# Altium schematic sheet AFPGA_power.SchDoc: Application FPGA
size 420 x 297 mm; CheckedBy: T.Janicki; CompanyName: Creotech Instruments SA; DrawnBy: G.Kasprowicz; Organization: CERN; Address1: European Organization for Nuclear Research; Address2: CH-1211 Geneve 23 - Switzerland; DocumentNumber: 10; Revision: -; SheetNumber: 8; SheetTotal: 21; EDA_Number: EDA-xxxx; Projet: Simple VME FMC Carrier; CreateDate: 20/11/2012; CheckedDate: 30/04/2012; Title2: power supply; DivGrp: BE-CO; Designer: G.Kasprowicz; DocumentName: AFPGA_power.SchDoc; ModifiedDate: -; Rule: PcbType=ProtelPcb
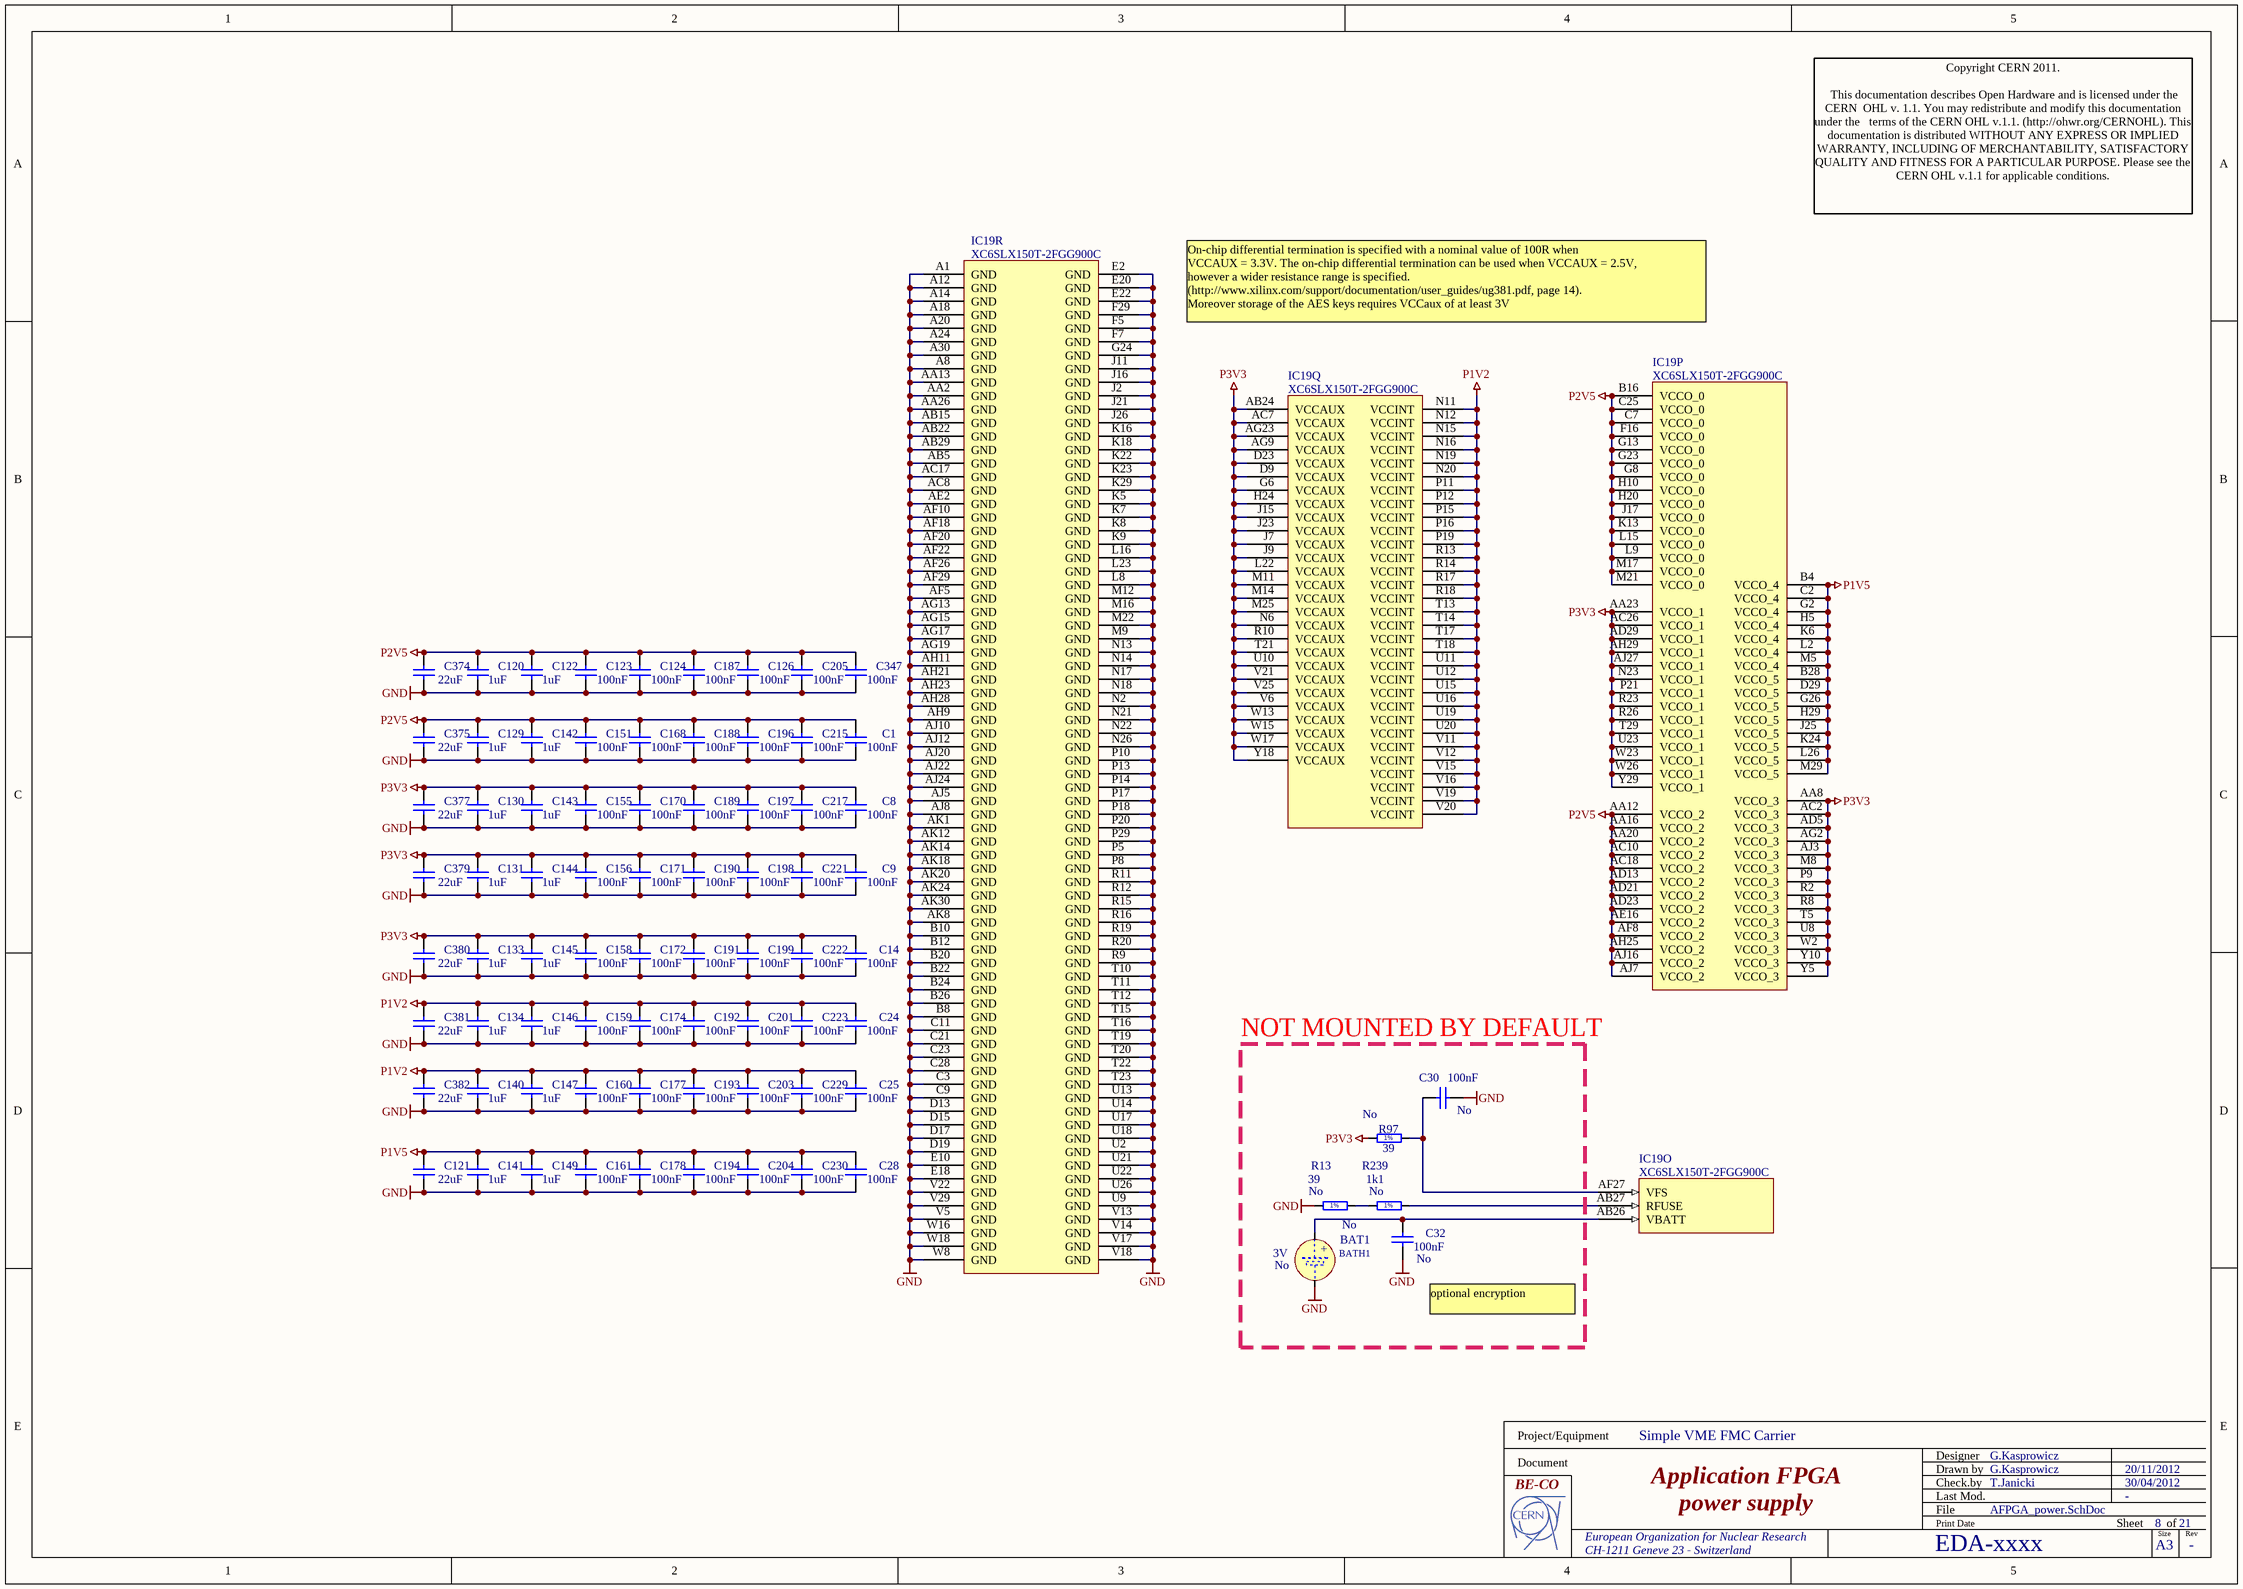
[diagram p0: AFPGA_power.SchDoc]

## Parts
BAT1  3V  Mounted: No  [BAT_VARTA_CR1220]
BATH1  Mounted: No  [BATH_KEYSTONE_3000]
C1  100nF  [CAPC1005X55N]
C8  100nF  [CAPC1005X55N]
C9  100nF  [CAPC1005X55N]
C14  100nF  [CAPC1005X55N]
C24  100nF  [CAPC1005X55N]
C25  100nF  [CAPC1005X55N]
C28  100nF  [CAPC1005X55N]
C30  100nF  Mounted: No  [CAPC1005X55N]
C32  100nF  Mounted: No  [CAPC1005X55N]
C120  1uF  [CAPC1608X87N]
C121  22uF  [CAPC3216X180N]
C122  1uF  [CAPC1608X87N]
C123  100nF  [CAPC1005X55N]
C124  100nF  [CAPC1005X55N]
C126  100nF  [CAPC1005X55N]
C129  1uF  [CAPC1608X87N]
C130  1uF  [CAPC1608X87N]
C131  1uF  [CAPC1608X87N]
C133  1uF  [CAPC1608X87N]
C134  1uF  [CAPC1608X87N]
C140  1uF  [CAPC1608X87N]
C141  1uF  [CAPC1608X87N]
C142  1uF  [CAPC1608X87N]
C143  1uF  [CAPC1608X87N]
C144  1uF  [CAPC1608X87N]
C145  1uF  [CAPC1608X87N]
C146  1uF  [CAPC1608X87N]
C147  1uF  [CAPC1608X87N]
C149  1uF  [CAPC1608X87N]
C151  100nF  [CAPC1005X55N]
C155  100nF  [CAPC1005X55N]
C156  100nF  [CAPC1005X55N]
C158  100nF  [CAPC1005X55N]
C159  100nF  [CAPC1005X55N]
C160  100nF  [CAPC1005X55N]
C161  100nF  [CAPC1005X55N]
C168  100nF  [CAPC1005X55N]
C170  100nF  [CAPC1005X55N]
C171  100nF  [CAPC1005X55N]
C172  100nF  [CAPC1005X55N]
C174  100nF  [CAPC1005X55N]
C177  100nF  [CAPC1005X55N]
C178  100nF  [CAPC1005X55N]
C187  100nF  [CAPC1005X55N]
C188  100nF  [CAPC1005X55N]
C189  100nF  [CAPC1005X55N]
C190  100nF  [CAPC1005X55N]
C191  100nF  [CAPC1005X55N]
C192  100nF  [CAPC1005X55N]
C193  100nF  [CAPC1005X55N]
C194  100nF  [CAPC1005X55N]
C196  100nF  [CAPC1005X55N]
C197  100nF  [CAPC1005X55N]
C198  100nF  [CAPC1005X55N]
C199  100nF  [CAPC1005X55N]
C201  100nF  [CAPC1005X55N]
C203  100nF  [CAPC1005X55N]
C204  100nF  [CAPC1005X55N]
C205  100nF  [CAPC1005X55N]
C215  100nF  [CAPC1005X55N]
C217  100nF  [CAPC1005X55N]
C221  100nF  [CAPC1005X55N]
C222  100nF  [CAPC1005X55N]
C223  100nF  [CAPC1005X55N]
C229  100nF  [CAPC1005X55N]
C230  100nF  [CAPC1005X55N]
C347  100nF  [CAPC1005X55N]
C374  22uF  [CAPC3216X180N]
C375  22uF  [CAPC3216X180N]
C377  22uF  [CAPC3216X180N]
C379  22uF  [CAPC3216X180N]
C380  22uF  [CAPC3216X180N]
C381  22uF  [CAPC3216X180N]
C382  22uF  [CAPC3216X180N]
IC19  XC6SLX150T-2FGG900C  [BGA900C100P30X30_3100X3100X260]  (parts O,P,Q,R of 18)
R13  39  Mounted: No  [RESC1608X55N]
R97  39  Mounted: No  [RESC1608X55N]
R239  1k1  Mounted: No  [RESC1608X55N]

## Blocks framed on the sheet
NOT MOUNTED BY DEFAULT: BAT1 BATH1 C30 C32 R13 R97 R239

## Nets
GND: BATH1.2(MINUS) C1.1 C8.1 C9.1 C14.1 C24.1 C25.1 C28.1 C30.1 C32.1 C120.1 C121.1 C122.1 C123.1 C124.1 C126.1 C129.1 C130.1 C131.1 C133.1 C134.1 C140.1 C141.1 C142.1 C143.1 C144.1 C145.1 C146.1 C147.1 C149.1 C151.1 C155.1 C156.1 C158.1 C159.1 C160.1 C161.1 C168.1 C170.1 C171.1 C172.1 C174.1 C177.1 C178.1 C187.1 C188.1 C189.1 C190.1 C191.1 C192.1 C193.1 C194.1 C196.1 C197.1 C198.1 C199.1 C201.1 C203.1 C204.1 C205.1 C215.1 C217.1 C221.1 C222.1 C223.1 C229.1 C230.1 C347.1 C374.1 C375.1 C377.1 C379.1 C380.1 C381.1 C382.1 IC19.A1(GND) IC19.A8(GND) IC19.A12(GND) IC19.A14(GND) IC19.A18(GND) IC19.A20(GND) IC19.A24(GND) IC19.A30(GND) IC19.AA2(GND) IC19.AA13(GND) IC19.AA26(GND) IC19.AB5(GND) IC19.AB15(GND) IC19.AB22(GND) IC19.AB29(GND) IC19.AC8(GND) IC19.AC17(GND) IC19.AE2(GND) IC19.AF5(GND) IC19.AF10(GND) IC19.AF18(GND) IC19.AF20(GND) IC19.AF22(GND) IC19.AF26(GND) IC19.AF29(GND) IC19.AG13(GND) IC19.AG15(GND) IC19.AG17(GND) IC19.AG19(GND) IC19.AH9(GND) IC19.AH11(GND) IC19.AH21(GND) IC19.AH23(GND) IC19.AH28(GND) IC19.AJ5(GND) IC19.AJ8(GND) IC19.AJ10(GND) IC19.AJ12(GND) IC19.AJ20(GND) IC19.AJ22(GND) IC19.AJ24(GND) IC19.AK1(GND) IC19.AK8(GND) IC19.AK12(GND) IC19.AK14(GND) IC19.AK18(GND) IC19.AK20(GND) IC19.AK24(GND) IC19.AK30(GND) IC19.B8(GND) IC19.B10(GND) IC19.B12(GND) IC19.B20(GND) IC19.B22(GND) IC19.B24(GND) IC19.B26(GND) IC19.C3(GND) IC19.C9(GND) IC19.C11(GND) IC19.C21(GND) IC19.C23(GND) IC19.C28(GND) IC19.D13(GND) IC19.D15(GND) IC19.D17(GND) IC19.D19(GND) IC19.E2(GND) IC19.E10(GND) IC19.E18(GND) IC19.E20(GND) IC19.E22(GND) IC19.F5(GND) IC19.F7(GND) IC19.F29(GND) IC19.G24(GND) IC19.J2(GND) IC19.J11(GND) IC19.J16(GND) IC19.J21(GND) IC19.J26(GND) IC19.K5(GND) IC19.K7(GND) IC19.K8(GND) IC19.K9(GND) IC19.K16(GND) IC19.K18(GND) IC19.K22(GND) IC19.K23(GND) IC19.K29(GND) IC19.L8(GND) IC19.L16(GND) IC19.L23(GND) IC19.M9(GND) IC19.M12(GND) IC19.M16(GND) IC19.M22(GND) IC19.N2(GND) IC19.N13(GND) IC19.N14(GND) IC19.N17(GND) IC19.N18(GND) IC19.N21(GND) IC19.N22(GND) IC19.N26(GND) IC19.P5(GND) IC19.P8(GND) IC19.P10(GND) IC19.P13(GND) IC19.P14(GND) IC19.P17(GND) IC19.P18(GND) IC19.P20(GND) IC19.P29(GND) IC19.R9(GND) IC19.R11(GND) IC19.R12(GND) IC19.R15(GND) IC19.R16(GND) IC19.R19(GND) IC19.R20(GND) IC19.T10(GND) IC19.T11(GND) IC19.T12(GND) IC19.T15(GND) IC19.T16(GND) IC19.T19(GND) IC19.T20(GND) IC19.T22(GND) IC19.T23(GND) IC19.U2(GND) IC19.U9(GND) IC19.U13(GND) IC19.U14(GND) IC19.U17(GND) IC19.U18(GND) IC19.U21(GND) IC19.U22(GND) IC19.U26(GND) IC19.V5(GND) IC19.V13(GND) IC19.V14(GND) IC19.V17(GND) IC19.V18(GND) IC19.V22(GND) IC19.V29(GND) IC19.W8(GND) IC19.W16(GND) IC19.W18(GND) R13.1
P1V2: C24.2 C25.2 C134.2 C140.2 C146.2 C147.2 C159.2 C160.2 C174.2 C177.2 C192.2 C193.2 C201.2 C203.2 C223.2 C229.2 C381.2 C382.2 IC19.N11(VCCINT) IC19.N12(VCCINT) IC19.N15(VCCINT) IC19.N16(VCCINT) IC19.N19(VCCINT) IC19.N20(VCCINT) IC19.P11(VCCINT) IC19.P12(VCCINT) IC19.P15(VCCINT) IC19.P16(VCCINT) IC19.P19(VCCINT) IC19.R13(VCCINT) IC19.R14(VCCINT) IC19.R17(VCCINT) IC19.R18(VCCINT) IC19.T13(VCCINT) IC19.T14(VCCINT) IC19.T17(VCCINT) IC19.T18(VCCINT) IC19.U11(VCCINT) IC19.U12(VCCINT) IC19.U15(VCCINT) IC19.U16(VCCINT) IC19.U19(VCCINT) IC19.U20(VCCINT) IC19.V11(VCCINT) IC19.V12(VCCINT) IC19.V15(VCCINT) IC19.V16(VCCINT) IC19.V19(VCCINT) IC19.V20(VCCINT)
P1V5: C28.2 C121.2 C141.2 C149.2 C161.2 C178.2 C194.2 C204.2 C230.2 IC19.B4(VCCO_4) IC19.B28(VCCO_5) IC19.C2(VCCO_4) IC19.D29(VCCO_5) IC19.G2(VCCO_4) IC19.G26(VCCO_5) IC19.H5(VCCO_4) IC19.H29(VCCO_5) IC19.J25(VCCO_5) IC19.K6(VCCO_4) IC19.K24(VCCO_5) IC19.L2(VCCO_4) IC19.L26(VCCO_5) IC19.M5(VCCO_4) IC19.M29(VCCO_5)
P2V5: C1.2 C120.2 C122.2 C123.2 C124.2 C126.2 C129.2 C142.2 C151.2 C168.2 C187.2 C188.2 C196.2 C205.2 C215.2 C347.2 C374.2 C375.2 IC19.AA12(VCCO_2) IC19.AA16(VCCO_2) IC19.AA20(VCCO_2) IC19.AC10(VCCO_2) IC19.AC18(VCCO_2) IC19.AD13(VCCO_2) IC19.AD21(VCCO_2) IC19.AD23(VCCO_2) IC19.AE16(VCCO_2) IC19.AF8(VCCO_2) IC19.AH25(VCCO_2) IC19.AJ7(VCCO_2) IC19.AJ16(VCCO_2) IC19.B16(VCCO_0) IC19.C7(VCCO_0) IC19.C25(VCCO_0) IC19.F16(VCCO_0) IC19.G8(VCCO_0) IC19.G13(VCCO_0) IC19.G23(VCCO_0) IC19.H10(VCCO_0) IC19.H20(VCCO_0) IC19.J17(VCCO_0) IC19.K13(VCCO_0) IC19.L9(VCCO_0) IC19.L15(VCCO_0) IC19.M17(VCCO_0) IC19.M21(VCCO_0)
P3V3: C8.2 C9.2 C14.2 C130.2 C131.2 C133.2 C143.2 C144.2 C145.2 C155.2 C156.2 C158.2 C170.2 C171.2 C172.2 C189.2 C190.2 C191.2 C197.2 C198.2 C199.2 C217.2 C221.2 C222.2 C377.2 C379.2 C380.2 IC19.AA8(VCCO_3) IC19.AA23(VCCO_1) IC19.AB24(VCCAUX) IC19.AC2(VCCO_3) IC19.AC7(VCCAUX) IC19.AC26(VCCO_1) IC19.AD5(VCCO_3) IC19.AD29(VCCO_1) IC19.AG2(VCCO_3) IC19.AG9(VCCAUX) IC19.AG23(VCCAUX) IC19.AH29(VCCO_1) IC19.AJ3(VCCO_3) IC19.AJ27(VCCO_1) IC19.D9(VCCAUX) IC19.D23(VCCAUX) IC19.G6(VCCAUX) IC19.H24(VCCAUX) IC19.J7(VCCAUX) IC19.J9(VCCAUX) IC19.J15(VCCAUX) IC19.J23(VCCAUX) IC19.L22(VCCAUX) IC19.M8(VCCO_3) IC19.M11(VCCAUX) IC19.M14(VCCAUX) IC19.M25(VCCAUX) IC19.N6(VCCAUX) IC19.N23(VCCO_1) IC19.P9(VCCO_3) IC19.P21(VCCO_1) IC19.R2(VCCO_3) IC19.R8(VCCO_3) IC19.R10(VCCAUX) IC19.R23(VCCO_1) IC19.R26(VCCO_1) IC19.T5(VCCO_3) IC19.T21(VCCAUX) IC19.T29(VCCO_1) IC19.U8(VCCO_3) IC19.U10(VCCAUX) IC19.U23(VCCO_1) IC19.V6(VCCAUX) IC19.V21(VCCAUX) IC19.V25(VCCAUX) IC19.W2(VCCO_3) IC19.W13(VCCAUX) IC19.W15(VCCAUX) IC19.W17(VCCAUX) IC19.W23(VCCO_1) IC19.W26(VCCO_1) IC19.Y5(VCCO_3) IC19.Y10(VCCO_3) IC19.Y18(VCCAUX) IC19.Y29(VCCO_1) R97.1
NetBATH1_1: BATH1.1(PLUS) C32.2 IC19.AB26(VBATT)
NetC30_2: C30.2 IC19.AF27(VFS) R97.2
NetIC19_AB27: IC19.AB27(RFUSE) R239.2
NetR13_2: R13.2 R239.1

## Notes on the sheet
- Copyright CERN 2011.
  This documentation describes Open Hardware and is licensed under the CERN  OHL v. 1.1. You may redistribute and modify this documentation under the   terms of the CERN OHL v.1.1. (http://ohwr.org/CERNOHL). This  documentation is distributed WITHOUT ANY EXPRESS OR IMPLIED  WARRANTY, INCLUDING OF MERCHANTABILITY, SATISFACTORY  QUALITY AND FITNESS FOR A PARTICULAR PURPOSE. Please see the  CERN OHL v.1.1 for applicable conditions.
- On-chip differential termination is specified with a nominal value of 100R when
  VCCAUX = 3.3V. The on-chip differential termination can be used when VCCAUX = 2.5V,
  however a wider resistance range is specified. (http://www.xilinx.com/support/documentation/user_guides/ug381.pdf, page 14).
  Moreover storage of the AES keys requires VCCaux of at least 3V
- (near C32) optional encryption
- Project/Equipment
- Document
- Designer
- Drawn by
- Check.by
- File
- Last Mod.
- Print Date
- Sheet
- Size
- A3
- of
- Rev
- (in symbol BAT_VARTA_CR1220) +
- (in symbol BATH_KEYSTONE_3000) +
- (in symbol R0603_1K1_1%_0.1W_100PPM) 1%
- (in symbol R0603_39R_1%_0.1W_100PPM) 1%

## Library data of the parts
BAT1 = BAT_VARTA_CR1220: Battery for use only with Socket Holder; Part Description: CR1210, 12.5mm Diameter x 2mm  Height Lithium Coin Cells; Manufacturer: VARTA; Manufacturer Part Number: 6220; Power: 35mAh; Table: Batteries; Part Number: BAT_VARTA_CR1220; Component Kind: Standard; Component Type: Standard; Pin Count: 0; PackageDescription: CR1210, 12.5mm Diameter x 2mm  Height Lithium Coin Cells; Family: Battery; Socket: Yes; SMD: No; Value: 3V; ComponentHeight: 2mm; HelpURL: \\cern.ch\dfs\Applications\Altium\Datasheets\BAT_VARTA_CR1220.pdf; Author: CERN DEM JLC; CreateDate: 2012-04-17; LatestRevisionDate: 2012-04-17
BATH1 = BATH_KEYSTONE_3000: Battery Holder whit 2 Pin; Part Description: SMD Battery Holders for BR1216, CR1216, BR1220, CL1220, CR1220, BR1225 Coin Cells; Manufacturer Part Number: 3000; Table: Batteries; Part Number: BATH_KEYSTONE_3000; Component Kind: Standard; Component Type: Standard; Pin Count: 3; PackageDescription: SMD Battery Holders for BR1216, CR1216, BR1220, CL1220, CR1220, BR1225 Coin Cells; Family: Battery; Socket: No; SMD: No; Manufacturer: KEYSTONE; ComponentHeight: 3.17mm; HelpURL: \\cern.ch\dfs\Applications\Altium\Datasheets\BATH_KEYSTONE_3000.pdf; Author: CERN DEM JLC; CreateDate: 2012-04-17; LatestRevisionDate: 2012-04-17
C1 C8 C9 C14 C24 C25 C28 C30 C32 C123 C124 C126 C151 C155 C156 C158-C161 C168 C170-C172 C174 C177 C178 C187-C194 C196-C199 C201 C203-C205 C215 C217 C221-C223 C229 C230 C347 = CC0402_100NF_16V_10%_X7R: Non-polarised capacitor; Part Description: SMD Multilayer Chip Ceramic Capacitor; Manufacturer: GENERIC; Manufacturer1 Part Number: 223878715649; Voltage: 16V; TC: X7R; Tolerance: ±10%; Table: Capacitors SMD; Part Number: CC0402_100NF_16V_10%_X7R; Component Kind: Standard; Component Type: Standard; Pin Count: 2; Value: 100nF; Status: Not Recommended; Manufacturer Part Number: CC0402_100NF_16V_10%_X7R; Case: 0402; Socket: No; SMD: Yes; Manufacturer1 Example: PHYCOMP; Manufacturer1 ComponentHeight: 0.55mm; HelpURL: \\cern.ch\dfs\Applications\Altium\Datasheets\CC0402_X7R_PHYCOMP.pdf; Author: CERN DEM JLC; CreateDate: 03/12/2007; LatestRevisionDate: 03/12/2007
  C1 C8 C9 C14 C24 C25 C28 C123 C124 C126 C151 C155 C156 C158-C161 C168 C170-C172 C174 C177 C178 C187-C194 C196-C199 C201 C203-C205 C215 C217 C221-C223 C229 C230 C347: Mounted: Yes
C120 C122 C129-C131 C133 C134 C140-C147 C149 = CC0603_1UF_16V_10%_X7R: Non-polarised capacitor; Part Description: SMD Multilayer Chip Ceramic Capacitor; Manufacturer: GENERIC; Manufacturer1 Part Number: 223824613663; Voltage: 16V; TC: X7R; Tolerance: ±10%; Table: Capacitors SMD; Part Number: CC0603_1UF_16V_10%_X7R; Component Kind: Standard; Component Type: Standard; Pin Count: 2; Value: 1uF; Status: Preferred; Manufacturer Part Number: CC0603_1uF_16V_10%_X7R; Case: 0603; Mounted: Yes; Socket: No; SMD: Yes; Manufacturer1 Example: PHYCOMP; Manufacturer1 ComponentHeight: 0.87mm; HelpURL: \\cern.ch\dfs\Applications\Altium\Datasheets\CC0805_X5R_PHYCOMP_HC.pdf; Author: CERN DEM JLC; CreateDate: 03/12/2007; LatestRevisionDate: 03/12/2007
C121 C374 C375 C377 C379-C382 = CC1206_22UF_10V_10%_X7R: Non-polarised capacitor; Part Description: SMD Multilayer Chip Ceramic Capacitor; Manufacturer: GENERIC; Manufacturer1 Part Number: GRM31CR71A226KE15L; Voltage: 10V; TC: X7R; Tolerance: ±10%; Table: Capacitors SMD; Part Number: CC1206_22UF_10V_10%_X7R; Component Kind: Standard; Component Type: Standard; Pin Count: 2; Value: 22uF; Status: Preferred; Manufacturer Part Number: CC1206_22UF_10V_10%_X7R; Case: 1206; Mounted: Yes; Socket: No; SMD: Yes; Manufacturer1 Example: MURATA; Manufacturer1 ComponentHeight: 1.8mm; HelpURL: \\cern.ch\dfs\Applications\Altium\Datasheets\CC1206_X7R_MURATA_GRM-HI-CAP.pdf; Author: CERN DEM JLC; CreateDate: 2010-06-08; LatestRevisionDate: 2010-06-08
IC19 = XC6SLX150T-2FGG900C: SPARTAN-6, FPGA, 900-Ball BGA, Commercial Grade, Pb-Free; Part Description: SPARTAN-6, FPGA, 540 User I/Os, 8 GTPs, 900-Ball BGA, Commercial Grade, Pb-Free; Manufacturer: XILINX; Table: Logic; Part Number: XC6SLX150T-2FGG900C; Component Kind: Standard; Component Type: Standard; Device: XC6SLX150T-2FGG900C; PackageDescription: BGA,1.00mm pitch, square; 900 pin, 30 columns X 30 rows, 31.00mm X 31.00mm X 2.60mm H, IPC Medium Density; Manufacturer Part Number: XC6SLX150T-2FGG900C; Pin Count: 900; Case: BGA900; Mounted: Yes; Socket: No; SMD: Yes; ComponentHeight: 2.6mm; HelpURL: \\cern.ch\dfs\Applications\Altium\Datasheets\XC6SLX150T-2FGG900C.pdf; ComponentLink1URL: \\cern.ch\dfs\Applications\Altium\Datasheets\XC6SLX150T-2FGG900C_Package-Pinouts.pdf; ComponentLink1Description: Package/Pinouts; Author: CERN DEM JLC; CreateDate: 2009-11-17; LatestRevisionDate: 2009-11-17
R13 R97 = R0603_39R_1%_0.1W_100PPM: Resistor - 1%; Part Description: General Purpose Thick Film Chip Resistor; Manufacturer: GENERIC; Manufacturer1 Part Number: NRC06F39R0TRF; Power: 0.1W; TC: ±100ppm/°C; Table: Resistors SMD; Part Number: R0603_39R_1%_0.1W_100PPM; Component Kind: Standard; Component Type: Standard; Pin Count: 2; Value: 39; Status: Preferred; Tolerance: ±1%; Manufacturer Part Number: R0603_39R_1%_0.1W_100PPM; Case: 0603; Socket: No; SMD: Yes; Manufacturer1 Example: NIC COMPONENT; Manufacturer1 ComponentHeight: 0.55mm; HelpURL: \\cern.ch\dfs\Applications\Altium\Datasheets\R0603_NIC_NRC.pdf; Author: CERN DEM JLC; CreateDate: 2007-12-03; LatestRevisionDate: 2008-03-13
R239 = R0603_1K1_1%_0.1W_100PPM: Resistor - 1%; Part Description: General Purpose Thick Film Chip Resistor; Manufacturer: GENERIC; Manufacturer1 Part Number: NRC06F1101TRF; Power: 0.1W; TC: ±100ppm/°C; Table: Resistors SMD; Part Number: R0603_1K1_1%_0.1W_100PPM; Component Kind: Standard; Component Type: Standard; Pin Count: 2; Value: 1k1; Status: Preferred; Tolerance: ±1%; Manufacturer Part Number: R0603_1K1_1%_0.1W_100PPM; Case: 0603; Socket: No; SMD: Yes; Manufacturer1 Example: NIC COMPONENT; Manufacturer1 ComponentHeight: 0.55mm; HelpURL: \\cern.ch\dfs\Applications\Altium\Datasheets\R0603_NIC_NRC.pdf; Author: CERN DEM JLC; CreateDate: 2007-12-03; LatestRevisionDate: 2008-03-13